# Altium schematic sheet Clock.SchDoc: Hrafn
size Tabloid; DrawnBy: Nicholas Belsten; Organization: MIT; Address1: Route 40; Address2: Westford MA 01886; Address3: USA; DocumentNumber: 6; SheetNumber: 8; SheetTotal: 10; DCN: Aika; ProgramName: AERO-VISTA; Section: Clock
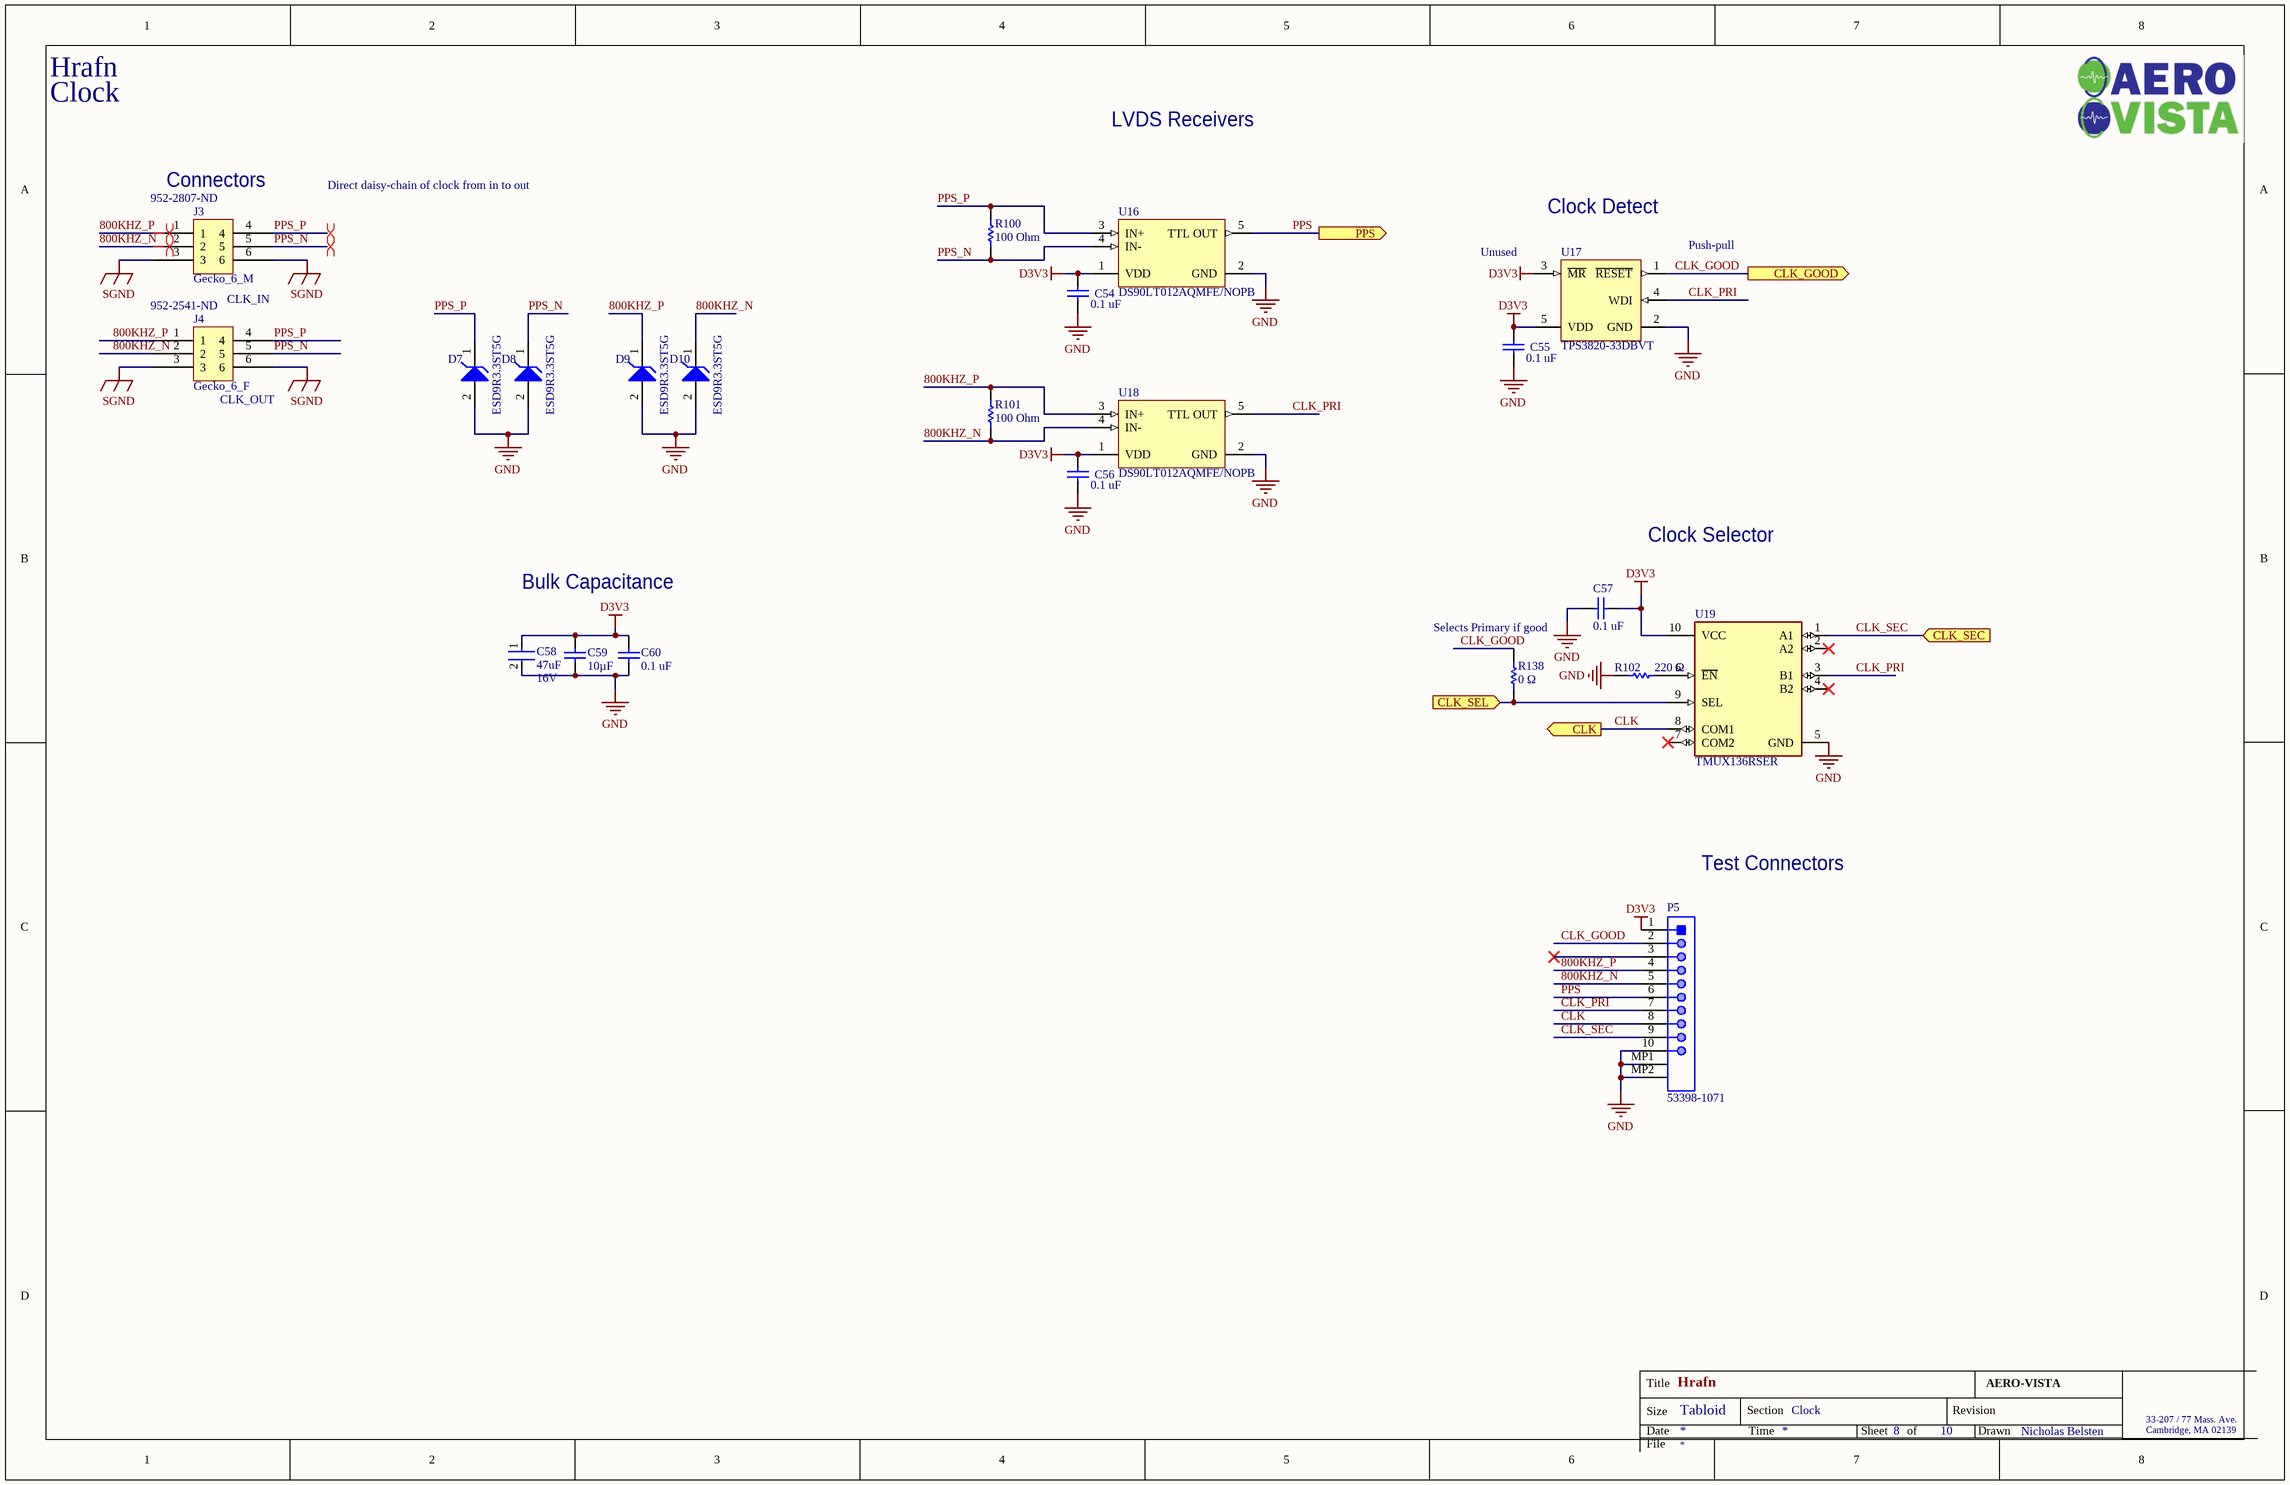
[diagram p0: Clock.SchDoc]

## Parts
C54  0.1 uF  [CAPC0402(1005)60_L]
C55  0.1 uF  [CAPC0402(1005)60_L]
C56  0.1 uF  [CAPC0402(1005)60_L]
C57  0.1 uF  [CAPC0402(1005)60_L]
C58  Capacitance: 47uF  Voltage Rating: 16V  [FP-GRT32E-0_3-IPC_C]  (hidden comment: GRT32EC81C476ME13L)
C59  Capacitance: 10µF  [CAPC1608X100X35LL20T25]  (hidden comment: EMK107BBJ106MA-T)
C60  0.1 uF  [CAPC0402(1005)60_L]
D7  ESD9R3.3ST5G  [ONSC-SOD-923-2-514AB-01_V]
D8  ESD9R3.3ST5G  [ONSC-SOD-923-2-514AB-01_V]
D9  ESD9R3.3ST5G  [ONSC-SOD-923-2-514AB-01_V]
D10  ESD9R3.3ST5G  [ONSC-SOD-923-2-514AB-01_V]
J3  Gecko_6_M  Supplier Part Number 1: 952-2807-ND  [GECK6_M]
J4  Gecko_6_F  Supplier Part Number 1: 952-2541-ND  [GECK6_F]
P5  53398-1071  [MOLX-53398-1071_V]
R100  100 Ohm  [RESC1005X40X25LL05T05]
R101  100 Ohm  [RESC1005X40X25LL05T05]
R102  220 Ω  [RESC1005X40X25LL05T05]
R138  Resistance: 0 Ω  [RESC1005X40X25LL05T05]  (hidden comment: ERJ2GE0R00X)
U16  DS90LT012AQMFE/NOPB  [MF05A_L]
U17  TPS3820-33DBVT  [DBV0005A_N]
U18  DS90LT012AQMFE/NOPB  [MF05A_L]
U19  TMUX136RSER  [FP-RSE0010A-MFG]

## Ports
CLK (out), CLK_GOOD (out), CLK_SEC (in), CLK_SEL (in), PPS (out)

## Nets
D3V3: C54.2 C55.2 C56.2 C57.1 C58.1 C59.2 C60.2 P5.1 U16.1(VDD) U17.3(~{MR}) U17.5(VDD) U18.1(VDD) U19.10(VCC)
GND: C54.1 C55.1 C56.1 C57.2 C58.2 C59.1 C60.1 D7.2(A) D8.2(A) D9.2(A) D10.2(A) P5.10 P5.MP1 P5.MP2 R102.1 U16.2(GND) U17.2(GND) U18.2(GND) U19.5(GND)
SGND: J3.3 J3.6 J4.3 J4.6
800KHZ_N: D10.1(K) J3.2 J4.2 P5.5 R101.1 U18.4(IN-)
800KHZ_P: D9.1(K) J3.1 J4.1 P5.4 R101.2 U18.3(IN+)
CLK: P5.8 U19.8(COM1) ; port CLK
CLK_GOOD: P5.2 R138.2 U17.1(~{RESET}) ; port CLK_GOOD
CLK_PRI: P5.7 U17.4(WDI) U18.5(TTL_OUT) U19.3(B1)
CLK_SEC: P5.9 U19.1(A1) ; port CLK_SEC
CLK_SEL: R138.1 U19.9(SEL) ; port CLK_SEL
PPS: P5.6 U16.5(TTL_OUT) ; port PPS
PPS_N: D8.1(K) J3.5 J4.5 R100.1 U16.4(IN-)
PPS_P: D7.1(K) J3.4 J4.4 R100.2 U16.3(IN+)
NetR102_2: R102.2 U19.6(~{EN})

Not connected (* = marked no-connect by the designer): P5 3*; U19 2(A2)* 4(B2)* 7(COM2)*

## Layout directives
differential pair; differential pair class LVDS: 800KHZ_N, 800KHZ_P, PPS_N, PPS_P

## Notes on the sheet
- LVDS Receivers
- (near J3) Connectors
- Direct daisy-chain of clock from in to out
- Clock Detect
- CLK_IN
- (near U17) Unused
- (near U17) Push-pull
- (near J4) CLK_OUT
- Clock Selector
- Bulk Capacitance
- Selects Primary if good
- Test Connectors
- Title
- Size
- Date
- Tabloid
- Section
- Time
- Sheet
- of
- Revision
- Drawn
- 33-207 / 77 Mass. Ave.
- Cambridge, MA 02139
- File

## Library data of the parts
C54-C57 C60 = CMP-1034-02068-1: CAP 100nF 16V ±5% 0402 (1005 Metric) Thickness 0.6mm SMD; Tolerance: Â±5%; Case-EIA: 0402; Case-Metric: 1005; Technology: SMT; Value: 100nF; Max Thickness: 0.6 mm; Rated Voltage: 16 V
C58 = CMP-06035-034903-1: Multi-Layer Ceramic Capacitor 47uF 16V X6S ±20% 1210 Emboss T/R; Ratings: AEC-Q200; Thickness: 0.106inch; Max Operating Temperature: 105°C; Width: 0.098inch; Case/Package: 1210; Length: 0.126inch; Mount: Surface Mount; Min Operating Temperature: -55°C; Tolerance: 20%; Case Code (Imperial): 1210; Case Code (Metric): 3225; Packaging: Tape and Reel
C59 = CMP-2000-06226-1: Chip Capacitor, 10 uF, +/- 20%, 16 V, -55 to 85 degC, 0603 (1608 Metric), RoHS, Tape and Reel; Manufacturer: Taiyo Yuden; Voltage - Rated: 16V; Temperature Coefficient: X5R; Other Names: 587-3238-6; Online Catalog: MSeries; Features: -; Thickness (Max): 0.031"(0.80mm); Package / Case: 0603(1608Metric); Datasheet URL: http://www.yuden.co.jp/ut/product/category/capacitor/EMK107BBJ106MA-T.pdf; Category: Capacitors; Lead Style: -; Family: CeramicCapacitors; Package Description: 2-Pin Surface Mount Device, Body 1.70 x 0.90 mm; Tolerance: ±20%; Manufacturer URL: http://www.t-yuden.com/; Operating Temperature: -55°C~85°C; Lead Spacing: -; Height - Seated (Max): -; Series: M; Applications: GeneralPurpose; Size / Dimension: 0.063"Lx0.031"W(1.60mmx0.80mm); Standard Package: 1; Packaging: Digi-Reel®; Mounting Technology: SurfaceMount; Package Reference: 0603; Ratings: -; Datasheet Version: 10/2016; Mounting Type: SurfaceMount,MLCC
D7-D10 = CMP-1063-00117-1: Transient Voltage Suppressor, ESD Protection Diode with Ultra-Low Leakage, 2-Pin SOD-923, Pb-Free, Tape and Reel; Manufacturer: On Semiconductor; C Max (pF): 0.9; V(BR) Min (V): 4.8; Number of Lines: 1; Direction: Unidirectional; IR Max (uA): 0.001; VRWM Max (V): 3.3; PackageReference: SOD-923-2-514AB-01; ComponentLink3URL: http://www.onsemi.com/pub_link/Collateral/514AB.PDF; DatasheetVersion: Rev. 1; PackageDescription: 2-Pin SOD, Body 0.8 x 0.6 mm; ComponentLink1URL: http://www.onsemi.com/; ComponentLink2Description: Datasheet; ComponentLink3Description: Package Specification; Packing: Tape and Reel; ComponentLink1Description: Manufacturer URL; ComponentLink2URL: http://www.onsemi.com/pub_link/Collateral/ESD9R3.3S-D.PDF; RoHS: Pb-Free; PackageVersion: Rev. C, 03/2011; Mounting Technology: Surface Mount; PartNumber: ESD9R3.3ST5G
J3 = Gecko_6_M: CONN HEADER VERT 6POS 1.25MM; Manufacturer 1: Harwin; Manufacturer Part Number 1: G125-MV10605L1P; Number of Positions: 6; Connector Type: Male Pin,Pin; Insulation Resistance: 10GR; Current Rating: 2A; Voltage Rating: 450V; Pitch: 0.049inch; Supplier 1: Digi-Key; RoHS: Yes; Category: Headers and Wire Housings; Stock 1: 132; Pricing 1: 1=4.22000, 10=4.04600, 100=3.37200, 500=2.86620, 1000=2.44470, 5000=2.19180 (USD); Mount: Through Hole; Color: Green; Weight: 0.008184oz; Housing Material: Polyamide; Contact Plating: Gold; Contact Material: Bronze; Min Operating Temperature: -65°C; Max Operating Temperature: 150°C; Packaging: Cut Strip; Termination: Solder; Fastening Type: Latch; Package Quantity: 1; Number of Rows: 2; Row Spacing: 0.049inch; Flammability Rating: UL94 V-0; ComponentLink1URL: http://www.mouser.com/ds/2/181/C125XX_G125_Gecko_Connectors-1131202.pdf?src-supplier=Mouser; ComponentLink1Description: http://www.mouser.com/ds/2/181/C125XX_G125_Gecko_Connectors-1131202.pdf?src-supplier=Mouser; ComponentLink2URL: https://cdn.harwin.com/pdfs/G125-MVXXX05LXP.pdf?src-supplier=Digi-Key; ComponentLink2Description: https://cdn.harwin.com/pdfs/G125-MVXXX05LXP.pdf?src-supplier=Digi-Key
J4 = Gecko_6_F: Gecko DIL Female Vertical 3mm PC Tail Connector, gold, pick & place (cut tape packing), 3+3 contacts; Manufacturer 1: Harwin; Manufacturer Part Number 1: G125-FV10605L0P; Current Rating: 2A; Voltage Rating: 450V; Connector Type: Receptacle,Socket; Number of Positions: 6; Insulation Resistance: 10GR; Pitch: 0.049inch; Supplier 1: Digi-Key; RoHS: Yes; Category: Headers and Wire Housings; Stock 1: 4137; Pricing 1: 1=6.94000, 10=6.64700, 100=5.49100, 500=4.62400, 1000=4.04600, 5000=3.75700 (USD); Mount: Through Hole; Housing Material: Polyamide; Contact Plating: Gold; Contact Material: Copper Alloy; Weight: 0.006843oz; Min Operating Temperature: -65°C; Max Operating Temperature: 150°C; Packaging: Bulk; Number of Rows: 2; Contact Gender: Female; Termination: Solder; Package Quantity: 1; Row Spacing: 0.049inch; Contact Post Length: 3mm; Flammability Rating: UL94 V-0; ComponentLink1URL: http://www.farnell.com/datasheets/1805453.pdf?src-supplier=Farnell; ComponentLink1Description: http://www.farnell.com/datasheets/1805453.pdf?src-supplier=Farnell; ComponentLink2URL: http://www.mouser.com/ds/2/181/C125XX_G125_Gecko_Connectors-1131202.pdf?src-supplier=Mouser; ComponentLink2Description: http://www.mouser.com/ds/2/181/C125XX_G125_Gecko_Connectors-1131202.pdf?src-supplier=Mouser; ComponentLink3URL: https://cdn.harwin.com/pdfs/G125-FVXXX05L0P.pdf?src-supplier=Digi-Key; ComponentLink3Description: https://cdn.harwin.com/pdfs/G125-FVXXX05L0P.pdf?src-supplier=Digi-Key; Parameter 1: *
P5 = CMP-2000-05635-1: Male Header, Pitch 1.25 mm, 1 x 10 Position, Height 4.7 mm, -40 to 85 degC, RoHS, Tape and Reel; Manufacturer: Molex; Mounting Angle: Vertical; Pitch: 1.25mm; Voltage Rating: 125V; Current Rating: 1A; Number of Rows: 1Row; Housing Material: Nylon; Mounting Technology: SurfaceMount; Mounting Style: SMD; Contact Material: PhosphorBronze; Product: Headers; Datasheet URL: http://www.molex.com/pdm_docs/sd/533981071_sd.pdf; Manufacturer URL: http://www.molex.com/; Datasheet Version: Rev. J, 09/2015; Factory Pack Quantity: 1000; Brand: Molex; Packaging: Reel; Product Category: Headers&WireHousings; Contact Gender: Pin(Male); Number of Positions: 10Position; RoHS: Details; Contact Plating: Tin; Package Description: Male Header, Pitch 1.25 mm, 1 x 10 Position, Height 4.7 mm; Series: 53398; Type: Shrouded; Package Reference: 53398-1071; Tradename: PicoBlade; Termination Style: SMD
R100 R101 = CMP-2002-00605-3: Chip Resistor, 100 Ohm, +/- 1%, 100 mW, -55 to 155 degC, 0402 (1005 Metric), RoHS, Tape and Reel; Manufacturer: Basic Passives; PartNumber: ERJ-2RKF1000X; Power Rating: 100 mW; Voltage Rating: 50 V; Case\/Package: 0402; Width: 0.5 mm; Pins: 2; ComponentLink2Description: Datasheet; PackageReference: 0402; Height: 0.35 mm; Tolerance: 1%; DatasheetVersion: 04/2015; Case Code (Imperial): 0402; Min Operating Temperature: -55 degC; Radiation Hardening: No; Length: 1 mm; Package Quantity: 10000; PackageDescription: 2-Pin Surface Mount Device, Body 1 x 0.5 mm; Mounting Technology: Surface Mount; Case Code (Metric): 1005; Packaging: Tape and Reel; ComponentLink1URL: http://www.panasonic.com/; RoHSCompliant: true; Max Operating Temperature: 155 degC; REACH SVHC: Yes; ComponentLink1Description: Manufacturer URL; Resistance: 100 Ohm; ComponentLink2URL: http://industrial.panasonic.com/cdbs/www-data/pdf/RDA0000/AOA0000C86.pdf; Mount: Surface Mount
R102 = CMP-2002-08356-1: Part Number: CRCW040220K0FKED; Manufacturer: Vishay Dale; Resistance: 220 Ω
R138 = CMP-2000-07451-1: Chip Resistor, 0 Ohm, 0.1 W, -55 to 155 degC, 0402 (1005 Metric), RoHS, Tape and Reel; Manufacturer: Panasonic; Voltage Rating (DC): 50V; Temperature Coefficient: 600ppm/��C; Max Power Dissipation: 100mW; Tolerance: 5%; Number of Terminations: 2; Mount: SurfaceMount; Height: 0.35mm; Packaging: TapeandReel; Contact Plating: Tin; Manufacturer URL: http://www.panasonic.com/; Composition: ThickFilm; Max Operating Temperature: 155degC; REACH SVHC: NoSVHC; Case/Package: 0402; Package Reference: 402; Depth: 0.5mm; Package Description: 2-Pin Surface Mount Device, Body 1 x 0.5 mm; Datasheet URL: https://industrial.panasonic.com/cdbs/www-data/pdf/RDA0000/AOA0000C301.pdf; RoHSCompliant: True; Case Code (Imperial): 0402; Military Standard: Not; Min Operating Temperature: -55degC; Power Rating: 100mW; Datasheet Version: 03/2015; Length: 1mm; Case Code (Metric): 1005; Termination: SMD/SMT; Mounting Technology: SurfaceMount; Voltage Rating: 50V; Width: 0.02inch; Package Quantity: 1; Lead Free: LeadFree; Radiation Hardening: No
U16 U18 = CMP-0058-01130-2: Automotive LVDS Differential Line Receiver, 5-pin SOT-23, Pb-Free; Manufacturer: National Semiconductor; PackageTopMarking: N03Q*XTT; CompType: Interface IC; PowerWise: N; ComponentLink3Description: MF05A Package Page; PackageVersion: revD, Aug-2008; ComponentLink2URL: http://www.national.com/pf/DS/DS90LT012AQ.html; RevisionNote: Component URLs added; PackageReference: MF05A; DatasheetVersion: Oct-2008; RoHS: Y; ComponentLink2Description: DS90LT012AQ Web Page; ComponentLink3URL: http://www.national.com/packaging/folders/mf05a.html; ComponentLink1URL: http://www.national.com/ds/DS/DS90LT012AQ.pdf; PinCount: 5; PackageDescription: Molded SOT-23, .115 x .063 x .040 in Body, 5 Lead, .0375 in Pitch; ComponentLink1Description: DS90LT012AQ Datasheet
U17 = CMP-0338-00013-2: Processor Supervisory Circuit, 1 Supply Monitored, -40 to 85 degC, 5-Pin SOT-23 (DBV), Green (RoHS & no Sb/Br); Manufacturer: Texas Instruments; Rating: Catalog; Time Delay: 25 ms; # of Supplies Monitored: 1; Output Driver Type / Reset Output: Active-low, Push-pull; Reset Threshold Accuracy: 2.4%; Threshold Voltage: 2.93 V Typ.; Watchdog Timer WDI: 0.2 s; Packing: Tape and Reel; VCC: 1.1 V Min.; Iq: 15 uA Typ.; Operating Temperature Range: -40 to 85 degC; RoHS: TRUE; DatasheetVersion: SLVS165J; PackageDescription: 5-Pin Plastic Small Outline, Body 1.6 x 2.9 mm, Pitch 0.95 mm; ComponentLink1URL: www.ti.com; Mounting Technology: Surface Mount; PartNumber: TPS3820-33DBVT; PackageVersion: 4073253-4/L; ComponentLink1Description: Manufacturer URL; ComponentLink3URL: http://www.ti.com/lit/ml/mpds018j/mpds018j.pdf; ComponentLink3Description: Package Specification; ComponentLink2Description: Datasheet; PackageReference: DBV0005A; ComponentLink2URL: http://www.ti.com/lit/ds/symlink/tps3820-33.pdf
U19 = CMP-04892-000024-1: IC SWITCH SPDT DUAL 10UQFN; Manufacturer: Texas Instruments; Max Supply Voltage: 4.8V; Number Of Circuits: 2; On State Resistance: 4.6/5.7Ω; Nominal Supply Current: 30uA; -3Db Bandwith: 6.1GHz; Mux Demux Ratio: 2:1; Standoff Height: 0mm; Min Supply Voltage: 2.3V; Description: 2 Circuit IC Switch 2:1 9.5Ohm 10-UQFN (2.0x1.5); Automotive: No; Temperature Range Low: -40°C; Throw Configuration: SPDT; Lead Free: Yes; Ipc Land Pattern Name: QFN50P150X200X55-10; Mouser Description: Dual SPDT, Low-Capacitance, 6.1 GHz Analog Switch 10-UQFN -40 to 85; Device Class L1: Integrated Circuits (ICs); Temperature Range High: +85°C; Package: RSE0010A; Manufacturer Part Number: TMUX136RSER; Ambient Temperature Range Low: -40°C; ComponentLink2Description: Datasheet; Octopart: https://octopart.com/tmux136rser-texas+instruments-86728646; Device Class L3: Analog Switches; Ambient Temperature Range High: +85°C; Category: IC; RoHS: TRUE; Device Class L2: Interface ICs; Temperature: -40°C to +85°C; Height: 0.6mm; Digikey Description: IC SWITCH SPDT DUAL 10UQFN; ComponentLink2URL: http://www.ti.com/lit/ds/symlink/tmux136.pdf; Footprint Url: http://www.ti.com/lit/ds/symlink/ts3a24157.pdf